# Altium schematic sheet PanQHDMI.SchDoc
size 330 x 381 mm
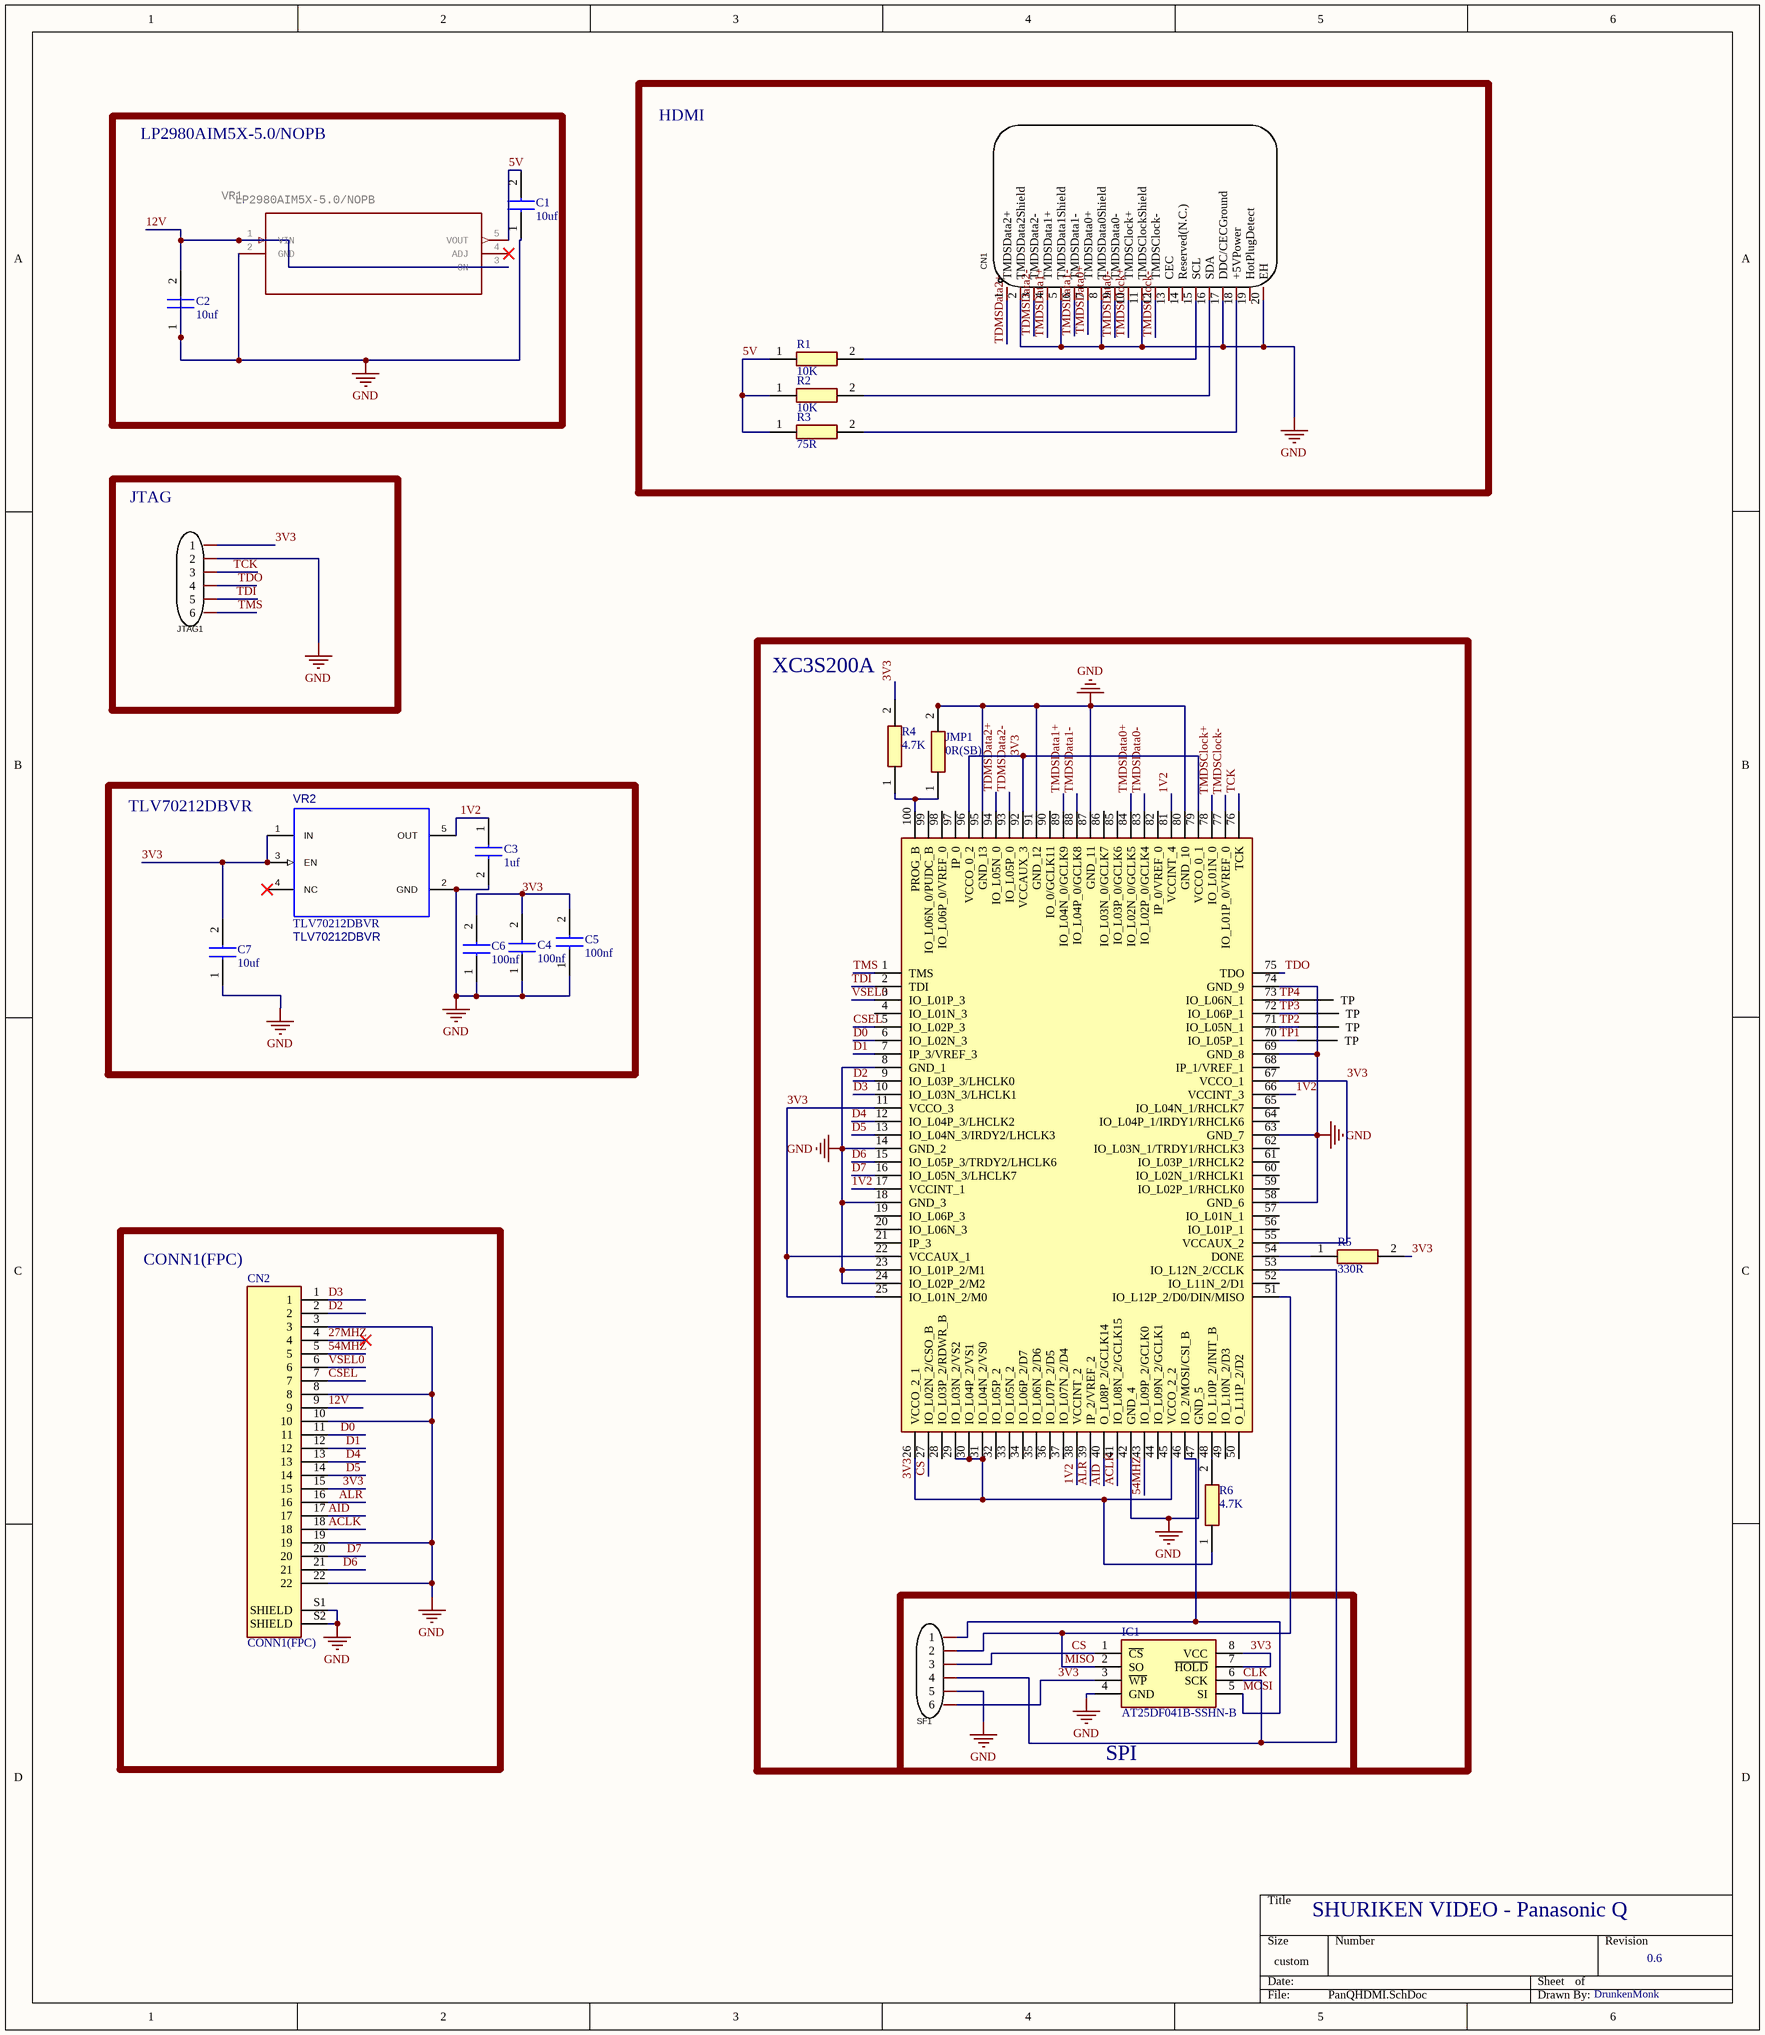
[diagram p0: PanQHDMI.SchDoc]

## Parts
C1  10uf  [RESC2012X50N]
C2  10uf  [RESC2012X50N]
C3  1uf  [RESC2012X50N]
C4  100nf  [RESC2012X50N]
C5  100nf  [RESC2012X50N]
C6  100nf  [RESC2012X50N]
C7  10uf  [RESC2012X50N]
CN1  10029449-111RLF  [HDMI-SMD_10029449-001RLF]  (value not drawn)
CN2  CONN1(FPC)  [XF3M122151B]
IC1  AT25DF041B-SSHN-B  [SOIC127P600X175-8N]
JMP1  0R(SB)  [RESC2012X50N]
JTAG1  2.54-1x6P直针  [TC2030MCP]  (value not drawn)
R1  10K  [RESC2012X50N]
R2  10K  [RESC2012X50N]
R3  75R  [RESC2012X50N]
R4  4.7K  [RESC2012X50N]
R5  330R  [RESC2012X50N]
R6  4.7K  [RESC2012X50N]
SF1  2.54-1x6P直针  [TC2030MCP]  (value not drawn)
TP1  Component_1  [TP1]  (value not drawn)
TP2  Component_1  [TP1]  (value not drawn)
TP3  Component_1  [TP1]  (value not drawn)
TP4  Component_1  [TP1]  (value not drawn)
U1  (no value)  [QFP50P1600X1600X120-100N]
VR1  LP2980AIM5X-5.0/NOPB  [MF05A_TEX]
VR2  TLV70212DBVR  [MF05A_TEX]

## Blocks framed on the sheet
HDMI: CN1 R1-R3
LP2980AIM5X-5.0/NOPB: C1 C2 VR1
JTAG: JTAG1
XC3S200A: JMP1 R4-R6 TP1-TP4 U1
TLV70212DBVR: C3-C7 VR2
CONN1(FPC): CN2
SPI: IC1 SF1

## Nets
GND: C1.1 C2.1 C3.2 C4.1 C5.1 C6.1 C7.1 CN1.2(TMDSData2Shield) CN1.5(TMDSData1Shield) CN1.8(TMDSData0Shield) CN1.11(TMDSClockShield) CN1.17(DDC/CECGround) CN1.20(EH) CN2.3 CN2.8 CN2.10 CN2.19 CN2.22 CN2.S1(SHIELD) CN2.S2(SHIELD) IC1.4(GND) JMP1.2 JTAG1.2 SF1.5 U1.8(GND_1) U1.14(GND_2) U1.18(GND_3) U1.23(IO_L01P_2/M1) U1.24(IO_L02P_2/M2) U1.42(GND_4) U1.47(GND_5) U1.58(GND_6) U1.63(GND_7) U1.69(GND_8) U1.74(GND_9) U1.80(GND_10) U1.87(GND_11) U1.91(GND_12) U1.95(GND_13) VR1.2(GND) VR2.2(GND)
1V2: C3.1 U1.17(VCCINT_1) U1.38(VCCINT_2) U1.66(VCCINT_3) U1.81(VCCINT_4) VR2.5(OUT)
3V3: C4.2 C5.2 C6.2 C7.2 CN2.15 IC1.3(~{WP}) IC1.7(~{HOLD}) IC1.8(VCC) JTAG1.1 R4.2 R5.2 R6.1 SF1.6 U1.11(VCCO_3) U1.22(VCCAUX_1) U1.25(IO_L01N_2/M0) U1.26(VCCO_2_1) U1.29(IO_L03N_2/VS2) U1.30(IO_L04P_2/VS1) U1.31(IO_L04N_2/VS0) U1.45(VCCO_2_2) U1.55(VCCAUX_2) U1.67(VCCO_1) U1.79(VCCO_0_1) U1.92(VCCAUX_3) U1.96(VCCO_0_2) VR2.1(IN) VR2.3(EN)
5V: C1.2 R1.1 R2.1 R3.1 VR1.5(VOUT)
12V: C2.2 CN2.9 VR1.1(VIN) VR1.3(ON)
27MHZ: CN2.4
54MHZ: CN2.5 U1.43(IO_L09P_2/GCLK0)
ACLK: CN2.18 U1.41(IO_L08N_2/GCLK15)
AID: CN2.17 U1.40(O_L08P_2/GCLK14)
ALR: CN2.16 U1.39(IP_2/VREF_2)
CLK: IC1.6(SCK) SF1.4 U1.53(IO_L12N_2/CCLK)
CS: IC1.1(~{CS}) SF1.3 U1.27(IO_L02N_2/CSO_B)
CSEL: CN2.7 U1.5(IO_L02P_3)
D0: CN2.11 U1.6(IO_L02N_3)
D1: CN2.12 U1.7(IP_3/VREF_3)
D2: CN2.2 U1.9(IO_L03P_3/LHCLK0)
D3: CN2.1 U1.10(IO_L03N_3/LHCLK1)
D4: CN2.13 U1.12(IO_L04P_3/LHCLK2)
D5: CN2.14 U1.13(IO_L04N_3/IRDY2/LHCLK3)
D6: CN2.21 U1.15(IO_L05P_3/TRDY2/LHCLK6)
D7: CN2.20 U1.16(IO_L05N_3/LHCLK7)
MISO: IC1.2(SO) SF1.2 U1.51(IO_L12P_2/D0/DIN/MISO)
MOSI: IC1.5(SI) SF1.1 U1.46(IO_2/MOSI/CSI_B)
TCK: JTAG1.3 U1.76(TCK)
TDI: JTAG1.5 U1.2(TDI)
TDMSData2+: CN1.1(TMDSData2+) U1.94(IO_L05N_0)
TDMSData2-: CN1.3(TMDSData2-) U1.93(IO_L05P_0)
TDO: JTAG1.4 U1.75(TDO)
TMDSClock+: CN1.10(TMDSClock+) U1.78(IO_L01N_0)
TMDSClock-: CN1.12(TMDSClock-) U1.77(IO_L01P_0/VREF_0)
TMDSData0+: CN1.7(TMDSData0+) U1.84(IO_L02N_0/GCLK5)
TMDSData0-: CN1.9(TMDSData0-) U1.83(IO_L02P_0/GCLK4)
TMDSData1+: CN1.4(TMDSData1+) U1.89(IO_L04N_0/GCLK9)
TMDSData1-: CN1.6(TMDSData1-) U1.88(IO_L04P_0/GCLK8)
TMS: JTAG1.6 U1.1(TMS)
TP1: TP1.TP U1.70(IO_L05P_1)
TP2: TP2.TP U1.71(IO_L05N_1)
TP3: TP3.TP U1.72(IO_L06P_1)
TP4: TP4.TP U1.73(IO_L06N_1)
VSEL0: CN2.6 U1.3(IO_L01P_3)
NetCN1_15: CN1.15(SCL) R1.2
NetCN1_16: CN1.16(SDA) R2.2
NetCN1_18: CN1.18(+5VPower) R3.2
NetJMP1_1: JMP1.1 R4.1 U1.100(PROG_B)
NetR5_1: R5.1 U1.54(DONE)
NetR6_2: R6.2 U1.48(IO_L10P_2/INIT_B)

Not connected (* = marked no-connect by the designer): CN1 13(CEC) 14(Reserved(N.C.)) 19(HotPlugDetect); U1 4(IO_L01N_3) 19(IO_L06P_3) 20(IO_L06N_3) 21(IP_3) 28(IO_L03P_2/RDWR_B) 32(IO_L05P_2) 33(IO_L05N_2) 34(IO_L06P_2/D7) 35(IO_L06N_2/D6) 36(IO_L07P_2/D5) 37(IO_L07N_2/D4) 44(IO_L09N_2/GCLK1) 49(IO_L10N_2/D3) 50(O_L11P_2/D2) 52(IO_L11N_2/D1) 56(IO_L01P_1) 57(IO_L01N_1) 59(IO_L02P_1/RHCLK0) 60(IO_L02N_1/RHCLK1) 61(IO_L03P_1/RHCLK2) 62(IO_L03N_1/TRDY1/RHCLK3) 64(IO_L04P_1/IRDY1/RHCLK6) 65(IO_L04N_1/RHCLK7) 68(IP_1/VREF_1) 82(IP_0/VREF_0) 85(IO_L03P_0/GCLK6) 86(IO_L03N_0/GCLK7) 90(IO_0/GCLK11) 97(IP_0) 98(IO_L06P_0/VREF_0) 99(IO_L06N_0/PUDC_B); VR1 4(ADJ)*; VR2 4(NC)*

## Notes on the sheet
- SHURIKEN VIDEO - Panasonic Q
- 0.6
- DrunkenMonk

## Library data of the parts
C1-C7 = 08055A150JAT2A: Capacitor; Manufacturer_Name: Kyocera AVX; Datasheet Link: https://componentsearchengine.com/Datasheets/1/06031A100FAT2A.pdf; Height: 0.94mm; Manufacturer_Part_Number: 08055A150JAT2A; Mouser Part Number: 581-08055A150J; Mouser Price/Stock: https://www.mouser.co.uk/ProductDetail/AVX/08055A150JAT2A?qs=pZVDklL%2Fs8hiEua37sqbaA%3D%3D; Arrow Part Number: 08055A150JAT2A; Arrow Price/Stock: https://www.arrow.com/en/products/08055a150jat2a/avx?region=nac
CN1 = 10029449-111RLF: Manufacturer: Amphenol; Add into BOM: yes; Symbol: 10029449-111RLF; Device: 10029449-111RLF; LCSC Part Name: 10029449-111RLF; Supplier Part: C427307; Manufacturer Part: 10029449-111RLF; Supplier Footprint: SMD; JLCPCB Part Class: Extended Part; Datasheet: https://atta.szlcsc.com/upload/public/pdf/source/20190916/C428493_2220CBF119BDA60368E33A9DE2491E6D.pdf; Supplier: LCSC; Convert to PCB: yes
CN2 = 2-84953-2: Conn FPC Connector SKT 22 POS 1mm Solder RA SMD Automotive T/R; MF: TE Connectivity / AMP; Package: None; MP: 2-84953-2; SnapEDA_Link: https://www.snapeda.com/parts/2-84953-2/TE%20Connectivity%20/%20AMP/view-part/580667/?ref=snap; Check_prices: https://www.snapeda.com/parts/2-84953-2/TE%20Connectivity%20/%20AMP/view-part/580667/?ref=eda; Availability: Unavailable; Value: *; EU_RoHS_Compliance: Compliant; Price: None
IC1 = AT25DF041B-SSHN-B: Integrated Circuit; Manufacturer_Name: Renesas Electronics; Datasheet Link: https://www.renesas.com/us/en/products/memory-logic/non-volatile-memory/spi-nor-flash/dual-quad-spi-memory/at25df041b-4-mbit-165-v-36-v-range-spi-serial-flash-memory-dual-io-support; Height: 1.75mm; Manufacturer_Part_Number: AT25DF041B-SSHN-B; Mouser Part Number: 988-AT25DF041BSSHNB; Mouser Price/Stock: https://www.mouser.co.uk/ProductDetail/Renesas-Dialog/AT25DF041B-SSHN-B?qs=IS%252B4QmGtzzrzLjmp4oWaPw%3D%3D
JMP1 R1-R6 = CPF0805B102RE1: Resistor; Manufacturer_Name: TE Connectivity; Datasheet Link: http://docs-europe.electrocomponents.com/webdocs/13d1/0900766b813d116f.pdf; Height: 0.65mm; Manufacturer_Part_Number: CPF0805B102RE1
JTAG1 SF1 = 2.54-1x6P直针: Manufacturer: BOOMELE(博穆精密); Symbol: Header-Male-2.54_1x6; Add into BOM: yes; Pin Structure: 1x6P; Pitch: 2.54mm; Circluar Pins/Square Pins: Square Pins; Current Rating (Max): 3A; Device: 2.54-1x6P直针; LCSC Part Name: 间距:2.54mm 1x6P 直插 方针; Supplier Part: C37208; Manufacturer Part: 2.54-1x6P直针; Supplier Footprint: 插件,P=2.54mm; JLCPCB Part Class: Extended Part; Supplier: LCSC; Convert to PCB: yes; Row Spacing: -; Mounting Type: Straight; Number of Rows: Plugin; Number of Pins: 6P; Voltage Rating (Max): -; Length of Mating Pin: -; Insulation Height: -; Contact Plating: -; Operating Temperature Range: -40℃~+105℃; Color: Black
U1 = XC3S200A-4VQG100C: Integrated Circuit; Manufacturer_Name: AMD; Datasheet Link: http://www.xilinx.com/support/documentation/data_sheets/ds529.pdf; Height: 1.2mm; Manufacturer_Part_Number: XC3S200A-4VQG100C; Mouser Part Number: 217-C3S200A-4VQG100C; Mouser Price/Stock: https://www.mouser.co.uk/ProductDetail/Xilinx/XC3S200A-4VQG100C?qs=rrS6PyfT74eGc8DZ2cmrnA%3D%3D
VR1 = LP2980AIM5X-5.0/NOPB: MFR_NAME: Texas Instruments; GateName_1: A; SymbolName_1: LP2980AIM5-5.0; LibraryName: 5Vout; DeviceSetName: LP2980AIM5X-5.0/NOPB; Package: MF05A_TEX; COPYRIGHT: Copyright (C) 2024 Ultra Librarian. All rights reserved.; DIGIKEY_PART_NUMBER_1: LP2980AIM5X-5.0/NOPBCT-ND; DIGIKEY_PART_NUMBER_2: LP2980AIM5X-5.0/NOPBDKR-ND; DIGIKEY_PART_NUMBER_3: LP2980AIM5X-5.0/NOPBTR-ND; DIGIKEY_PART_NUMBER_4: 2156-LP2980AIM5X-5.0/NOPB-ND; DIGIKEY_PART_NUMBER_5: 2156-LP2980AIM5X-5.0/NOPB-TI-ND; MANUFACTURER_PART_NUMBER: LP2980AIM5X-5.0/NOPB
VR2 = TLV70212DBVR: ki_fp_filters: DBV0005A_N DBV0005A_M DBV0005A_L; Footprint: DBV0005A_N; Supplier: TLV70212DBVR; ki_keywords: TLV70212DBVR; Value: TLV70212DBVR